# EasyEDA schematic SCH_New-Project2_2024-12-12 (1).json
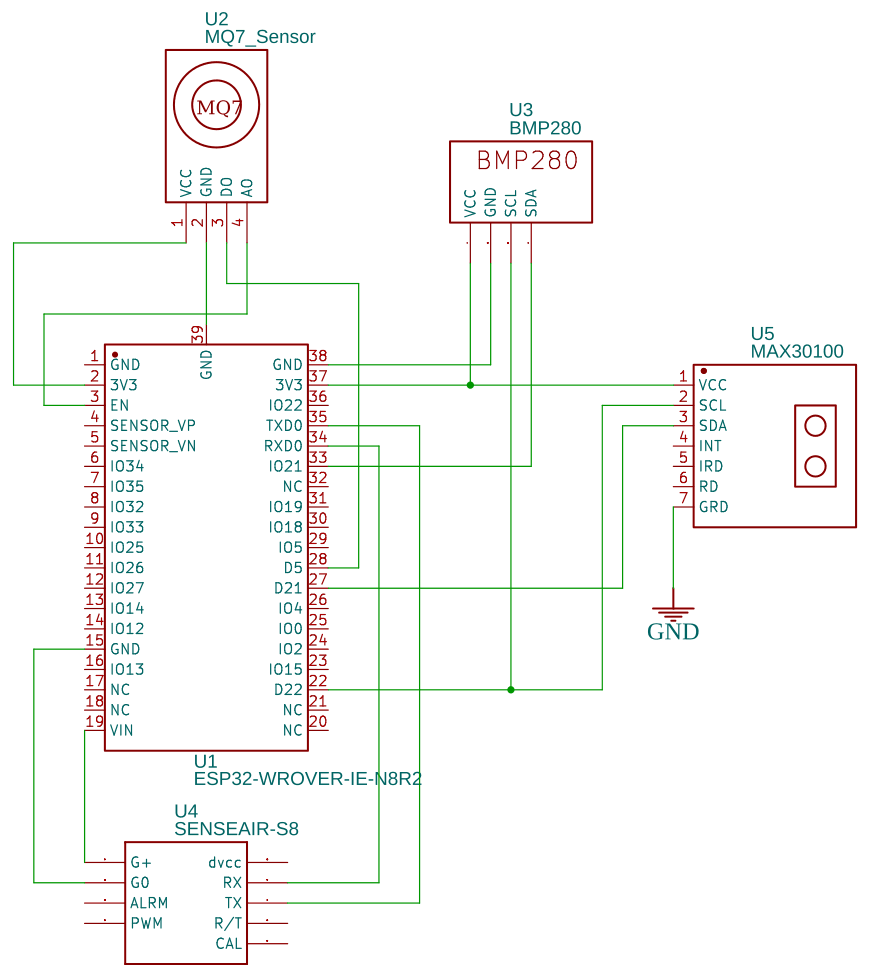
[diagram p0: schematic sheet]

## Parts
U1  ESP32-WROVER-IE-N8R2  [WIFI-SMD_ESP32-WROVER-E]
U2  MQ7_Sensor  [MQ7_SENSOR]
U3  BMP280  [BMP280YSF BMP280YSF BMP280YSF BMP]
U4  SENSEAIR-S8  [SENSEAIR-S8]
U5  MAX30100  [MAX30100EFD+]

## Library data of the parts
U1 = ESP32-WROVER-IE-N8R2: Supplier: LCSC; Supplier Part: C6552379; Manufacturer: ESPRESSIF(乐鑫); Contributor: lcsc; JLCPCB Part Class: Extended Part
U2 = MQ7_Sensor: Contributor: rusiru5707
U3 = BMP280: Contributor: p.c.abhemanyu
U4 = SENSEAIR-S8: Manufacturer Part: SENSEAIR S8; Supplier Part: undefined; Contributor: maxicusc
U5 = MAX30100: Supplier Part: C92512; Supplier: LCSC; Manufacturer: MAXIM; Contributor: Emmanuel1255

## Nets
GND: U5.7(GRD)
Net-(U1-2): U1.2(3V3) U2.1(VCC)
Net-(U1-3): U1.3(EN) U2.4(AO)
Net-(U1-15): U1.15(GND) U4.G0
Net-(U1-19): U1.19(VIN) U4.G+
Net-(U1-22): U1.22(D22) U3.5(SCL) U5.2(SCL)
Net-(U1-27): U1.27(D21) U5.3(SDA)
Net-(U1-28): U1.28(D5) U2.3(DO)
Net-(U1-33): U1.33(IO21) U3.4(SDA)
Net-(U1-34): U1.34(RXD0) U4.RX
Net-(U1-35): U1.35(TXD0) U4.TX
Net-(U1-37): U1.37(3V3) U3.7(VCC) U5.1(VCC)
Net-(U1-38): U1.38(GND) U3.6(GND)
Net-(U1-39): U1.39(GND) U2.2(GND)

Not connected (* = marked no-connect by the designer): U1 1(GND) 4(SENSOR_VP) 5(SENSOR_VN) 6(IO34) 7(IO35) 8(IO32) 9(IO33) 10(IO25) 11(IO26) 12(IO27) 13(IO14) 14(IO12) 16(IO13) 17(NC) 18(NC) 20(NC) 21(NC) 23(IO15) 24(IO2) 25(IO0) 26(IO4) 29(IO5) 30(IO18) 31(IO19) 32(NC) 36(IO22); U4 3.3V(dvcc) ALRM CAL PWM R/T; U5 4(INT) 5(IRD) 6(RD)
